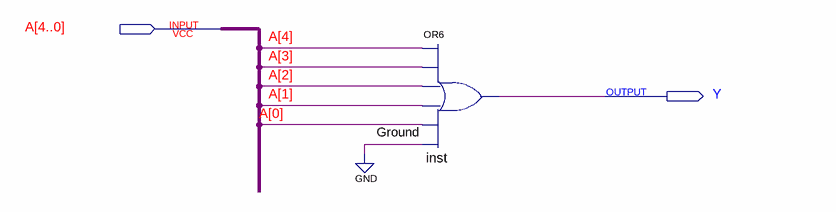
[diagram p0: schematic sheet]
// Quartus schematic NONZERO_5.bdf as structural Verilog: 1 symbols, 2 pins
module NONZERO_5 (
  input  [4:0] A,
  output Y
);

  or inst (Y, A[4], A[3], A[2], A[1], A[0], 1'b0);
endmodule
